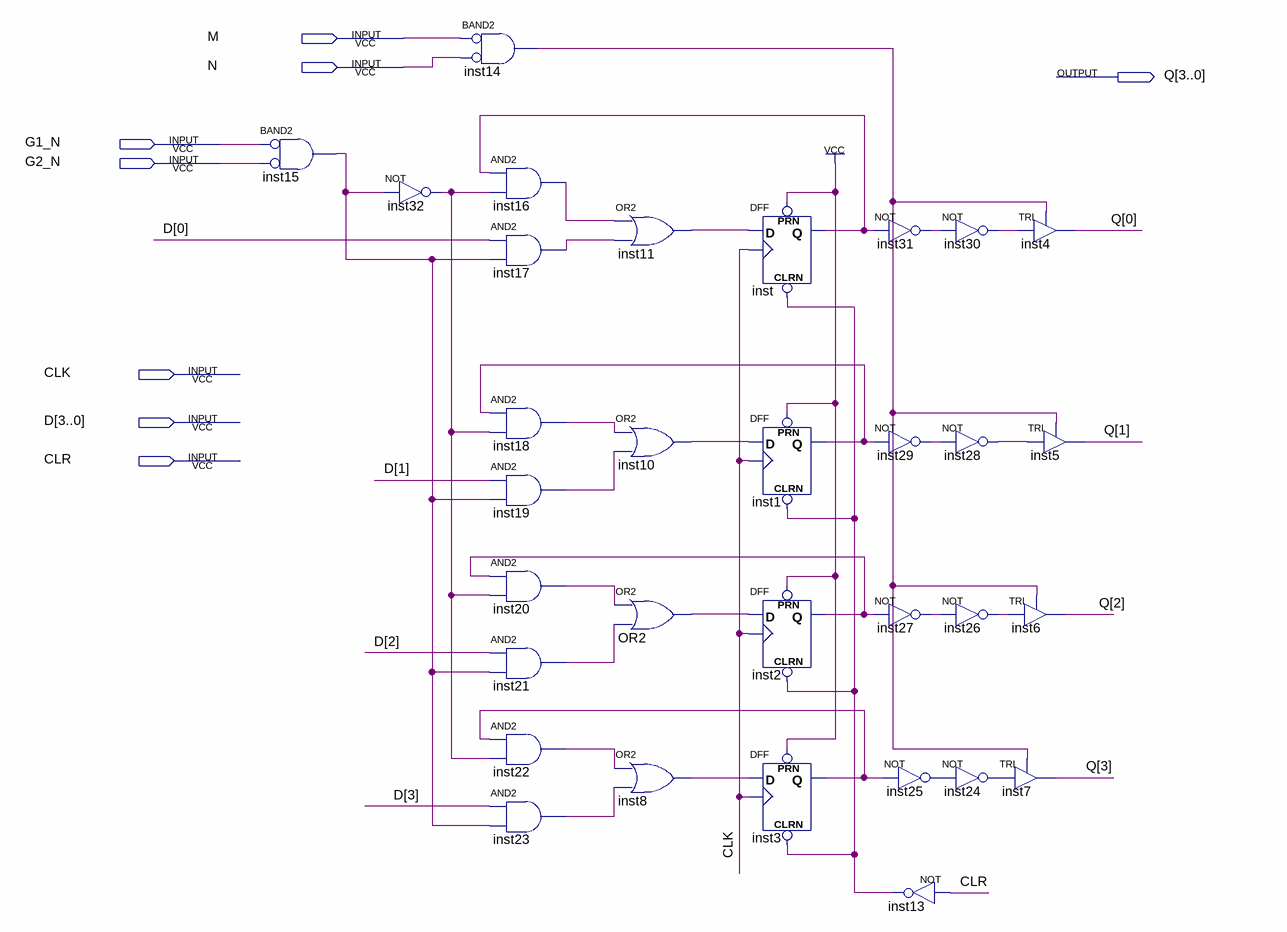
[diagram p0: schematic sheet]
// Quartus schematic REGISTRADOR_4BITS.bdf as structural Verilog: 32 symbols, 8 pins
module REGISTRADOR_4BITS (
  input  M,
  input  N,
  input  G1_N,
  input  G2_N,
  input  CLK,
  input  [3:0] D,
  input  CLR,
  output [3:0] Q
);

  wire inst1_q, inst2_q, inst3_q, inst8_out, inst10_out, inst11_out, inst13_out, inst14_out, inst15_out,
       inst16_out, inst17_out, inst18_out, inst19_out, inst20_out, inst21_out, inst22_out, inst23_out,
       inst24_out, inst25_out, inst26_out, inst27_out, inst28_out, inst29_out, inst30_out, inst31_out,
       inst32_out, inst_q, OR2_out;

  and inst15 (inst15_out, ~G1_N, ~G2_N);  // BAND2
  not inst32 (inst32_out, inst15_out);
  and inst14 (inst14_out, ~M, ~N);  // BAND2
  and inst16 (inst16_out, inst_q, inst32_out);
  and inst17 (inst17_out, D[0], inst15_out);
  and inst18 (inst18_out, inst1_q, inst32_out);
  and inst19 (inst19_out, D[1], inst15_out);
  and inst20 (inst20_out, inst2_q, inst32_out);
  and inst21 (inst21_out, D[2], inst15_out);
  and inst22 (inst22_out, inst3_q, inst32_out);
  and inst23 (inst23_out, D[3], inst15_out);
  or inst11 (inst11_out, inst16_out, inst17_out);
  or inst10 (inst10_out, inst18_out, inst19_out);
  or OR2 (OR2_out, inst20_out, inst21_out);
  or inst8 (inst8_out, inst22_out, inst23_out);
  DFF inst (.CLRN(inst13_out), .CLK(CLK), .D(inst11_out), .PRN(1'b1), .Q(inst_q));
  DFF inst1 (.CLRN(inst13_out), .CLK(CLK), .D(inst10_out), .PRN(1'b1), .Q(inst1_q));
  DFF inst2 (.CLRN(inst13_out), .CLK(CLK), .D(OR2_out), .PRN(1'b1), .Q(inst2_q));
  DFF inst3 (.CLRN(inst13_out), .CLK(CLK), .D(inst8_out), .PRN(1'b1), .Q(inst3_q));
  not inst31 (inst31_out, inst_q);
  not inst29 (inst29_out, inst1_q);
  not inst27 (inst27_out, inst2_q);
  not inst25 (inst25_out, inst3_q);
  not inst13 (inst13_out, CLR);
  not inst30 (inst30_out, inst31_out);
  not inst28 (inst28_out, inst29_out);
  not inst26 (inst26_out, inst27_out);
  not inst24 (inst24_out, inst25_out);
  TRI inst4 (.IN(inst30_out), .OE(inst14_out), .OUT(Q[0]));
  TRI inst5 (.IN(inst28_out), .OE(inst14_out), .OUT(Q[1]));
  TRI inst6 (.IN(inst26_out), .OE(inst14_out), .OUT(Q[2]));
  TRI inst7 (.IN(inst24_out), .OE(inst14_out), .OUT(Q[3]));
endmodule
